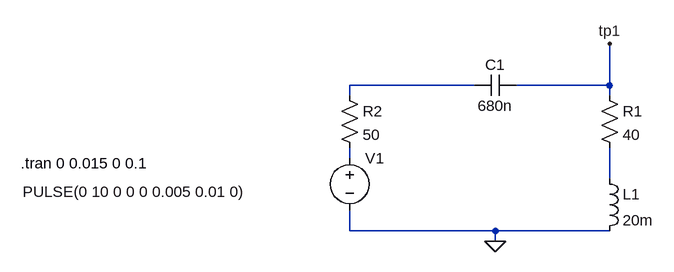
[diagram p0: schematic LTSPICE.asc]
LTSPICE.asc, the LTspice schematic file:
Version 4
SHEET 1 880 680
WIRE 256 48 64 48
WIRE 464 48 464 -16
WIRE 464 48 320 48
WIRE 64 64 64 48
WIRE 464 64 464 48
WIRE 64 160 64 144
WIRE 464 192 464 144
WIRE 64 272 64 240
WIRE 288 272 64 272
WIRE 464 272 288 272
WIRE 288 288 288 272
FLAG 288 288 0
FLAG 464 -16 tp1
SYMBOL voltage 64 144 R0
WINDOW 3 -503 68 Left 2
WINDOW 123 0 0 Left 0
WINDOW 39 0 0 Left 0
SYMATTR InstName V1
SYMATTR Value PULSE(0 10 0 0 0 0.005 0.01 0)
SYMBOL ind 448 176 R0
SYMATTR InstName L1
SYMATTR Value 20m
SYMBOL res 448 48 R0
SYMATTR InstName R1
SYMATTR Value 40
SYMBOL res 48 48 R0
SYMATTR InstName R2
SYMATTR Value 50
SYMBOL cap 320 32 R90
WINDOW 0 0 32 VBottom 2
WINDOW 3 32 32 VTop 2
SYMATTR InstName C1
SYMATTR Value 680n
TEXT -442 168 Left 2 !.tran 0 0.015 0 0.1

The netlist it stands for:
* LTSPICE.asc
V1 N002 0 PULSE(0 10 0 0 0 0.005 0.01 0)
L1 N003 0 20m
R1 tp1 N003 40
R2 N001 N002 50
C1 tp1 N001 680n
.tran 0 0.015 0 0.1
.backanno
.end